# EasyEDA Pro project exp7lb.eprj

# Schematic Schematic1
Board Name: Board1; Create Date: 2025-12-22; Page Name: P1; Project Name: exp7lb; Schematic Name: Schematic1; Update Date: 2025-12-23; Company: 嘉立创EDA; Page Size: A4; Version: V1.0
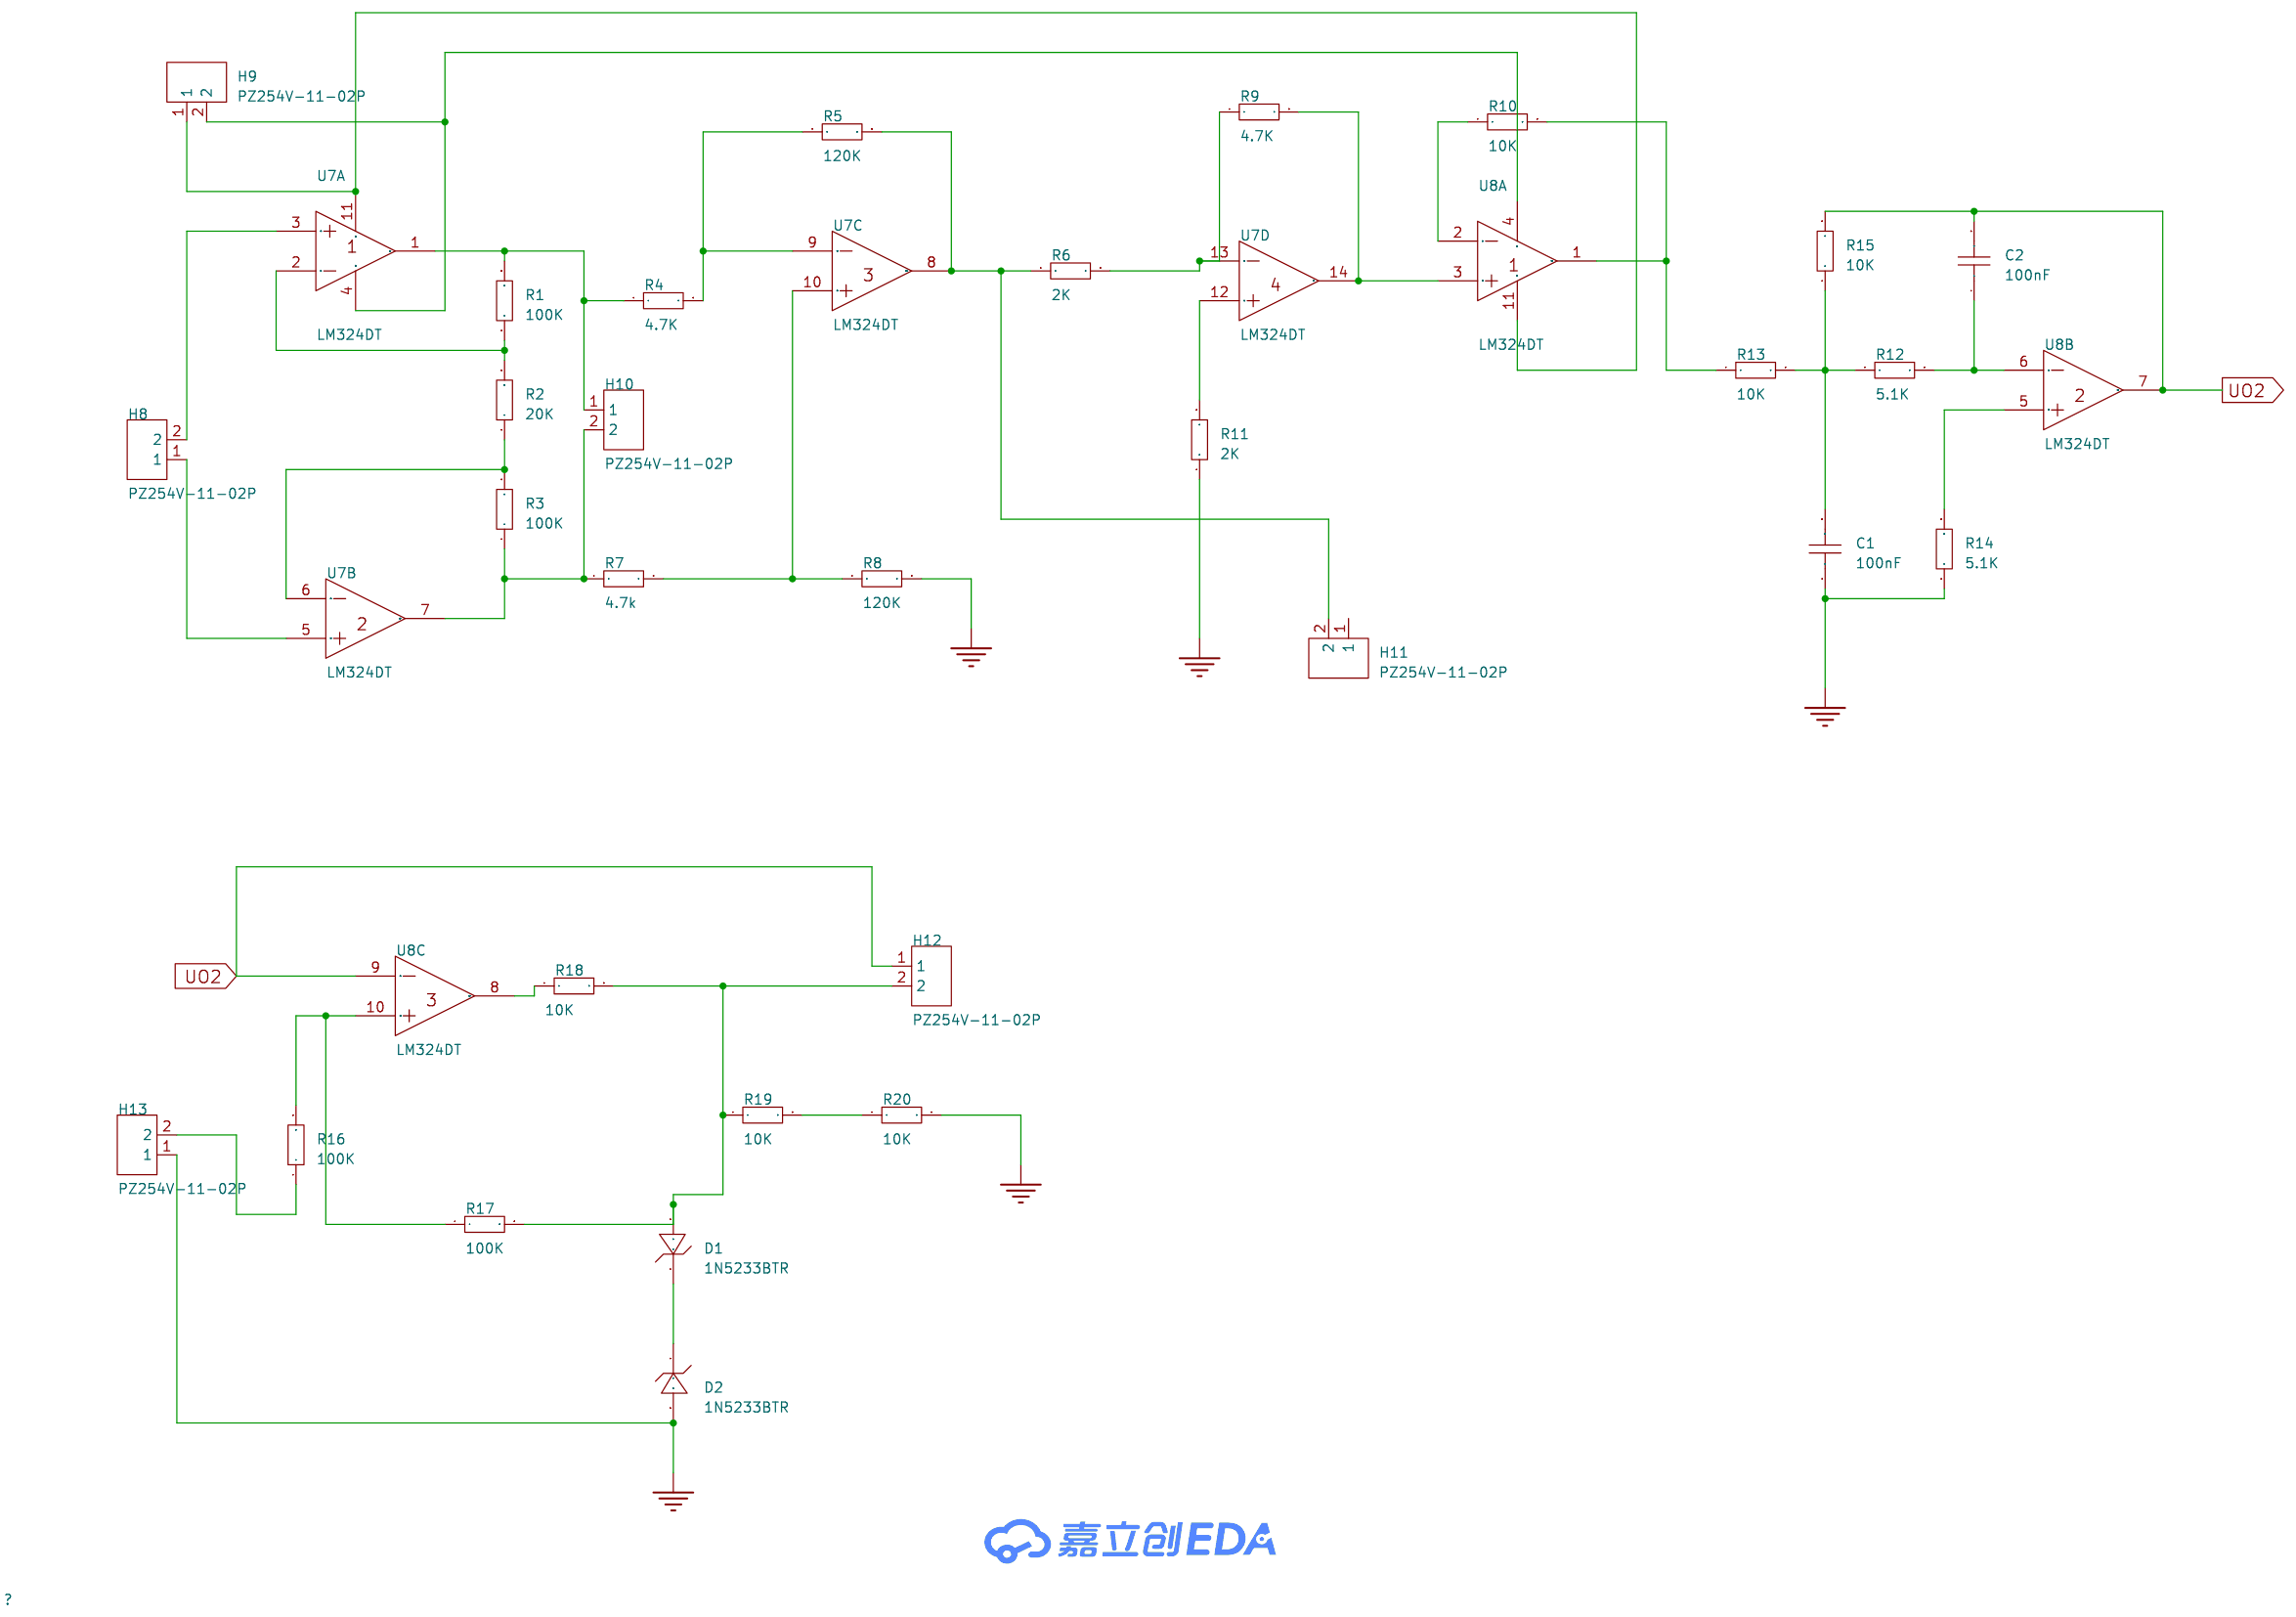
[diagram p0: schematic sheet]

## Parts
C1  100nF  [C0603]
C2  100nF  [C0603]
D1  1N5233BTR  [DO-35_BD2.0-L4.2-P8.20-D0.5-RD]
D2  1N5233BTR  [DO-35_BD2.0-L4.2-P8.20-D0.5-RD]
H8  PZ254V-11-02P  [HDR-TH_2P-P2.54-V-M]
H9  PZ254V-11-02P  [HDR-TH_2P-P2.54-V-M]
H10  PZ254V-11-02P  [HDR-TH_2P-P2.54-V-M]
H11  PZ254V-11-02P  [HDR-TH_2P-P2.54-V-M]
H12  PZ254V-11-02P  [HDR-TH_2P-P2.54-V-M]
H13  PZ254V-11-02P  [HDR-TH_2P-P2.54-V-M]
R1  100K  [R0603]
R2  20K  [R0603]
R3  100K  [R0603]
R4  4.7K  [R0603]
R5  120K  [R0603]
R6  2K  [R0603]
R7  4.7k  [R0603]
R8  120K  [R0603]
R9  4.7K  [R0603]
R10  10K  [R0603]
R11  2K  [R0603]
R12  5.1K  [R0603]
R13  10K  [R0603]
R14  5.1K  [R0603]
R15  10K  [R0603]
R16  100K  [R0603]
R17  100K  [R0603]
R18  10K  [R0603]
R19  10K  [R0603]
R20  10K  [R0603]
U7  LM324DT  [SOIC-14_L8.7-W3.9-P1.27-LS6.0-BL]  (sections 1,2,3,4)
U8  LM324DT  [SOIC-14_L8.7-W3.9-P1.27-LS6.0-BL]  (sections 1,2,3)

## Library data of the parts
C1 C2 = CAP_0603: Supplier Footprint: 0603
D1 D2 = 1N5233BTR: LCSC Part Name: 独立式 耐压:6V 电流:5uA; Supplier Part: C258176; Manufacturer: onsemi(安森美); Supplier Footprint: DO-35; JLCPCB Part Class: 扩展库; Datasheet: https://item.szlcsc.com/datasheet/1N5233BTR/251202.html; Supplier: LCSC; Diode Configuration: 独立式; Zener Voltage(Nom): 6V; Reverse Leakage Current (Ir): 5uA; Zener Voltage(Range): 5.7V~6.3V; Pd - Power Dissipation: 500mW; Impedance(Zzt): 7Ω; Impedance(Zzk): 1.6kΩ; Operating Junction Temperature Range: -65℃~+200℃
H8-H13 = PZ254V-11-02P: LCSC Part Name: 1x2P 间距:2.54mm 方针 直插; Supplier Part: C492401; Manufacturer: XFCN(兴飞); Supplier Footprint: 插件,P=2.54mm; JLCPCB Part Class: 扩展库; Datasheet: https://item.szlcsc.com/datasheet/PZ254V-11-02P/502957.html; Supplier: LCSC; Pin Structure: 1x2P; Pitch: 2.54mm; Circluar Pins/Square Pins: 方针; Mounting Type: 直插; Number of Rows: 单排; Number of Pins: 2P; Length of Mating Pin: 6mm; Insulation Height: 2.5mm; Length of End Connection Pin: 3mm; Contact Material: 黄铜; Operating Temperature: -40℃~+105℃; Color: 黑色
R1-R20 = Res_0603: Supplier Footprint: 0603
U7 U8 = LM324DT: LCSC Part Name: 低功耗四路运算放大器; Supplier Part: C71035; Manufacturer: ST(意法半导体); Supplier Footprint: SOIC-14; JLCPCB Part Class: 基础库; Datasheet: https://item.szlcsc.com/datasheet/LM324DT/72134.html; Supplier: LCSC; Number of Channels: 四路; Maximum Power Supply Range (Vdd-Vss): 30V; Gain Bandwidth Product: 1.3MHz; Vos - Input Offset Voltage: 5mV; Input Offset Voltage Drift(Vos TC): 30uV/℃; Slew Rate: 20V/us; Ib - Input Bias Current: 300nA; Input Offset Current(Ios): 20nA; Noise density(eN): 40nV/√Hz@1kHz; Common Mode Rejection Ratio(CMRR): 80dB; Input offset current drift(Ios TC): 200pA/℃; Quiescent Current: 1.2mA; Output Current: 70mA; Operating Temperature: 0℃~+70℃; Single supply: 3V~30V; Dual Supply: -15V~-1.5V；1.5V~15V

## Nets
GND: C1.1 D2.2 H13.1 R8.2 R11.1 R14.1 R20.2
UO2: C2.2 H12.1 R15.2 U8.7(OUT2) U8.9(IN3-)
$1N1789: H8.1 U7.5(IN2+)
$1N1795: R2.1 R3.2 U7.6(IN2-)
$1N1810: H10.2 R3.1 R7.1 U7.7(OUT2)
$1N1825: R7.2 R8.1 U7.10(IN3+)
$1N1857: H10.1 R1.2 R4.1 U7.1(OUT1)
$1N1892: R4.2 R5.1 U7.9(IN3-)
$1N1908: H11.2 R5.2 R6.1 U7.8(OUT3)
$1N1971: R6.2 R9.1 U7.13(IN4-)
$1N1988: R9.2 U7.14(OUT4) U8.3(IN1+)
$1N2003: R11.2 U7.12(IN4+)
$1N2040: R10.1 U8.2(IN1-)
$1N2046: R10.2 R13.1 U8.1(OUT1)
$1N2061: C1.2 R12.1 R13.2 R15.1
$1N2102: R14.2 U8.5(IN2+)
$1N2108: C2.1 R12.2 U8.6(IN2-)
$1N2191: R18.1 U8.8(OUT3)
$1N2196: R16.2 R17.1 U8.10(IN3+)
$1N2210: H13.2 R16.1
$1N2232: D1.1 D2.1
$1N2248: D1.2 H12.2 R17.2 R18.2 R19.1
$1N2279: R19.2 R20.1
$1N2425: H9.1 U7.11(VCC-) U8.11(VCC-)
$1N2444: H9.2 U7.4(VCC+) U8.4(VCC+)
$1N2454: R1.1 R2.2 U7.2(IN1-)
$1N2488: H8.2 U7.3(IN1+)

Not connected (* = marked no-connect by the designer): H11 1

# Board PCB2
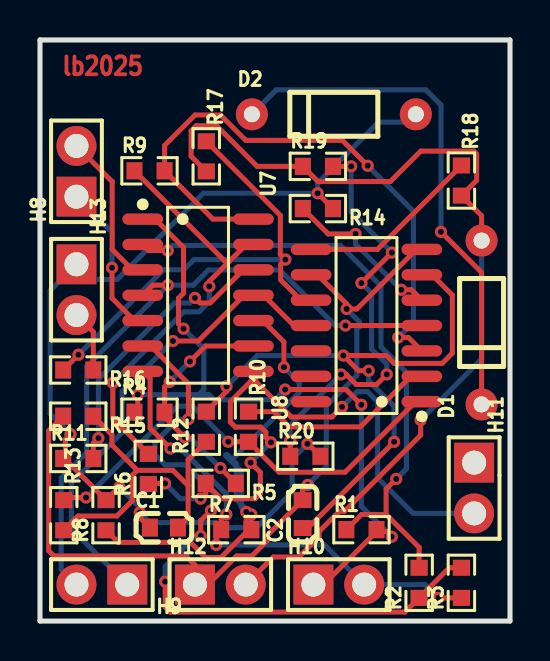
[diagram p1: board, top side]
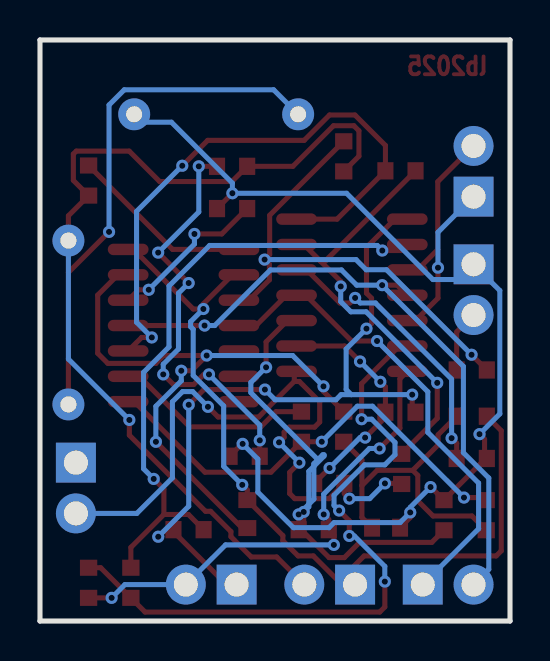
[diagram p2: board, bottom side, seen from below]

Outline 23.51 x 29.08 mm; copper layers: Top Layer, Bottom Layer. Coordinates in mm from the lower left corner of the outline.
Outline path: 0,29.08 23.51,29.08 23.51,0 0,0 0,29.08
Stack: Top Layer 0.035mm / Dielectric1 1.51mm FR4 er 4.5 / Bottom Layer 0.035mm

## Design rules (mm)
template: JLCPCB Capability(Two Layers Board)
spacing copperThickness1oz (default): track to track 0.102, other pairs 0.152 to 0.3
spacing copperThickness2oz: track to track 0.203, other pairs 0.152 to 0.3
track width copperThickness1oz (default): min 0.127, default 0.254, max 2.54
track width copperThickness2oz: min 0.203, default 0.254, max 2.54
differential pair differentialPair (default): width min 0.127, default 0.254, max 2.54; gap min 0.152, default 0.152
via viaSize (default): diameter min 0.5, default 0.61, max 10; hole min 0.3, default 0.305, max 6.3

## Placement (name value [footprint] x y rotation side)
C1  100nF  [C0603]  6.2 4.67 0 top
C2  100nF  [C0603]  13.14 5.35 90 top
D1  1N5233BTR  [DO-35_BD2.0-L4.2-P8.20-D0.5-RD]  22.08 14.94 90 top
D2  1N5233BTR  [DO-35_BD2.0-L4.2-P8.20-D0.5-RD]  14.7 25.36 0 top
H8  PZ254V-11-02P  [HDR-TH_2P-P2.54-V-M]  1.82 22.51 90 top
H9  PZ254V-11-02P  [HDR-TH_2P-P2.54-V-M]  3.09 1.82 180 top
H10  PZ254V-11-02P  [HDR-TH_2P-P2.54-V-M]  14.94 1.82 0 top
H11  PZ254V-11-02P  [HDR-TH_2P-P2.54-V-M]  21.71 6.66 270 top
H12  PZ254V-11-02P  [HDR-TH_2P-P2.54-V-M]  9.02 1.82 0 top
H13  PZ254V-11-02P  [HDR-TH_2P-P2.54-V-M]  1.82 16.58 270 top
R1  100K  [R0603]  16.08 4.57 0 top
R2  20K  [R0603]  18.96 1.91 90 top
R3  100K  [R0603]  21.07 1.91 90 top
R4  4.7K  [R0603]  5.48 10.45 0 top
R5  120K  [R0603]  9.04 6.89 180 top
R6  2K  [R0603]  5.42 7.61 90 top
R7  4.7k  [R0603]  9.82 4.57 0 top
R8  120K  [R0603]  3.3 5.3 90 top
R9  4.7K  [R0603]  5.48 22.53 0 top
R10  10K  [R0603]  10.43 9.73 270 top
R11  2K  [R0603]  1.91 8.14 0 top
R12  5.1K  [R0603]  8.32 9.73 90 top
R13  10K  [R0603]  1.19 5.3 270 top
R14  5.1K  [R0603]  13.9 20.64 180 top
R15  10K  [R0603]  1.91 10.25 180 top
R16  100K  [R0603]  1.91 12.57 180 top
R17  100K  [R0603]  8.32 23.26 270 top
R18  10K  [R0603]  21.07 22.05 270 top
R19  10K  [R0603]  13.9 22.76 0 top
R20  10K  [R0603]  13.27 8.25 0 top
U7  LM324DT  [SOIC-14_L8.7-W3.9-P1.27-LS6.0-BL]  7.91 16.31 270 top
U8  LM324DT  [SOIC-14_L8.7-W3.9-P1.27-LS6.0-BL]  16.33 14.79 90 top

## Footprints (pads in the part's own frame, mm; a bottom-side part is the same pattern mirrored in y, then rotated)
C0603
  rect 0.8x0.9 smd: 1(-0.7,0) 2(0.7,0)
DO-35_BD2.0-L4.2-P8.20-D0.5-RD
  round 1.6 hole 0.8: 1(-4.1,0) 2(4.1,0)
HDR-TH_2P-P2.54-V-M
  rect 2x2 hole 1.2: 1(-1.27,0)
  round 2 hole 1.2: 2(1.27,0)
R0603
  rect 0.806x0.864 smd: 1(-0.753,0) 2(0.753,0)
SOIC-14_L8.7-W3.9-P1.27-LS6.0-BL
  oval 0.574x2.038 smd: 1(-3.81,-2.769) 2(-2.54,-2.769) 3(-1.27,-2.769) 4(0,-2.769) 5(1.27,-2.769) 6(2.54,-2.769) 7(3.81,-2.769) 8(3.81,2.769) 9(2.54,2.769) 10(1.27,2.769) 11(0,2.769) 12(-1.27,2.769) 13(-2.54,2.769) 14(-3.81,2.769)

## Nets
As in the schematic.

Pads without a net: H11 1; U8 12 13 14

## Via types
v1: diameter 0.61, hole 0.305, Top Layer to Bottom Layer, 62 vias

## Routing (per net, layer and track width the routed paths; a pad name or vN(x,y) marks a point on that pad's centre or on a via; arc(x,y) is an arc through that point)
GND: length 51.9
  Top Layer w0.254: 1.27,8.08 1.27,9.1 v1(1.53,9.35) ; 1.27,8.08 1.21,8.08 R11.1 ; 1.27,8.08 R8.2 3.96,6.7 v1(3.97,6.7) ; v1(4.99,5.44) 4.99,5.18 5.5,4.67 ; 14.02,8.25 13.4,8.87 v1(13.37,8.87) ; v1(13.88,21.41) R14.1
  Bottom Layer w0.254: v1(13.37,8.87) 12.61,8.11 12.61,6.45 10.83,4.67 9.05,4.67 8.8,4.93 5.5,4.93 v1(4.99,5.44) 4.99,5.69 v1(3.97,6.7) ; v1(1.53,9.35) 0.51,10.37 0.51,16.54 H13.1 2.59,17.09 3.86,17.09 8.17,21.41 v1(13.88,21.41) 13.88,21.92 16.93,24.97 18.4,24.97 D2.2
UO2: length 41.7
  Top Layer w0.254: 8.57,1.99 7.3,3.26 0.69,3.26 0.44,3.51 0.44,9.53 R15.2 ; 8.57,1.99 9.84,3.26 10.6,3.26 11.36,4.02 11.36,4.28 C2.2 13.14,6.56 v1(13.39,6.81) ; 8.57,1.99 8.4,1.82 H12.1 ; U8.9 13.88,17.33 15.34,15.87 v1(15.34,15.62) 15.84,15.62 18.82,18.6 19.1,18.6
  Bottom Layer w0.254: v1(13.39,6.81) 14.32,7.74 14.32,10.77 15.84,12.29 15.84,14.6 15.97,14.73 15.97,14.98 v1(15.34,15.62)
$1N1789: length 7.8
  Top Layer w0.254: v1(3.6,17.68) 3.6,16.16 4.62,15.14 5.03,15.14 U7.5
  Bottom Layer w0.254: H8.1 3.6,19.46 v1(3.6,17.68)
$1N1795: length 34.1
  Top Layer w0.254: 5.14,13.77 5.25,13.66 5.64,13.66 7.42,11.88 v1(7.42,10.1) ; R3.2 20.47,2.67 R2.1 18.25,0.45 6.52,0.45 6.26,0.7 v1(6.26,1.97) ; v1(8.04,4.26) 8.04,5.02 v1(8.55,5.53)
  Bottom Layer w0.254: v1(8.55,5.53) 8.8,5.78 8.8,6.29 7.28,7.82 6.26,7.82 5.75,8.32 5.75,8.94 6.91,10.1 v1(7.42,10.1) ; v1(6.26,1.97) 6.26,2.74 7.78,4.26 v1(8.04,4.26)
$1N1810: length 24.3
  Top Layer w0.254: v1(19.92,1.16) R3.1 ; v1(8.81,3.81) 8.81,4.32 R7.1 9.06,5.08 v1(9.32,5.33) ; v1(6.52,8.64) 5.51,9.65 5.51,12.12 U7.7
  Bottom Layer w0.254: v1(6.52,8.64) 7.03,8.64 9.32,6.35 v1(9.32,5.33) ; v1(19.92,1.16) 19.26,1.82 H10.2 14.22,3.81 v1(8.81,3.81)
$1N1825: length 26.3
  Top Layer w0.254: R8.1 3.91,3.94 7.52,3.94 8.28,3.17 9.05,3.17 10.32,4.44 v1(10.32,5.46) ; R7.2 v1(10.57,5.33) ; U7.10 10.72,14.99 11.18,14.99 12.2,13.97 v1(12.2,12.7)
  Bottom Layer w0.254: 9.81,7.75 10.06,7.49 10.06,5.84 ; 9.81,7.75 9.81,7.88 9.55,8.13 ; 9.81,7.75 9.81,6.1 10.06,5.84 ; 9.81,7.75 9.3,8.25 9.3,8.32 9.36,8.32 9.55,8.13 ; 10.06,5.84 10.06,5.72 v1(10.32,5.46) ; 10.06,5.84 v1(10.57,5.33) ; 9.55,8.13 9.66,8.13 12.96,11.43 12.96,11.94 v1(12.2,12.7)
$1N1857: length 35.9
  Top Layer w0.254: v1(4.89,11.33) 4.89,10.62 R4.1 ; 16.83,4.47 14.18,1.82 H10.1 ; 16.83,4.47 R1.2 ; 16.83,4.47 17.34,4.47 v1(17.59,4.22) ; v1(16.07,10.82) 15.31,11.59 v1(12.26,11.59) ; U7.1 5.76,20.12 7.18,18.7 7.18,16.41 6.92,16.16 6.92,14.89 v1(7.18,14.63)
  Bottom Layer w0.254: v1(17.59,4.22) 16.07,5.74 v1(16.07,10.82) ; v1(7.18,14.63) 8.19,13.62 8.19,11.59 7.94,11.33 ; 7.94,11.33 8.45,11.33 8.7,11.08 11.75,11.08 v1(12.26,11.59) ; 7.94,11.33 v1(4.89,11.33)
$1N1892: length 11.7
  Top Layer w0.254: v1(7.25,9.18) 6.23,10.2 R4.2 6.23,11.72 v1(6.48,11.97) ; v1(9.02,7.66) R5.1 ; 10.68,13.77 8.28,13.77 v1(7.5,12.99)
  Bottom Layer w0.254: v1(6.48,11.97) v1(7.5,12.99) ; v1(7.25,9.18) 7.5,9.18 v1(9.02,7.66)
$1N1908: length 32.9
  Top Layer w0.254: R6.1 5.45,6.89 v1(6.25,6.89) ; v1(11.55,8.94) 11.3,9.2 11.3,9.45 11.04,9.7 9.77,9.7 9.52,9.96 9.52,10.97 10.53,11.99 10.79,11.99 ; 10.79,11.99 10.79,12.38 U7.8 ; 10.79,11.99 12.57,10.21 14.6,10.21 v1(15.11,10.72) ; v1(10.53,7.93) 11.02,7.44 11.02,6.38 10.77,6.13 9.05,6.13 R5.2 8.29,6.38 v1(8.03,6.13)
  Bottom Layer w0.254: v1(6.25,6.89) 7.02,6.13 v1(8.03,6.13) ; v1(15.11,10.72) 15.87,11.48 16.38,11.48 16.88,10.97 16.88,7.16 18.66,5.39 H11.2 ; v1(11.55,8.94) v1(10.53,7.93)
$1N1971: length 21.4
  Top Layer w0.254: v1(3.64,11.92) 3.64,10.14 5.42,8.37 ; 9.48,18.02 10.31,18.85 U7.13 ; 9.48,18.02 8.47,17 v1(8.47,16.75) ; 9.48,18.02 9.24,18.02 R9.1
  Bottom Layer w0.254: v1(8.47,16.75) 8.47,15.99 7.96,15.48 7.2,15.48 v1(3.64,11.92)
$1N1988: length 29.9
  Top Layer w0.254: v1(17.91,14.19) 18.42,14.19 19.1,13.52 ; U7.14 8.65,20.12 R9.2 6.23,23.8 7.75,25.33 9.02,25.33 10.29,24.06 15.12,24.06 v1(16.39,22.79)
  Bottom Layer w0.254: v1(16.39,22.79) 18.68,20.5 18.68,14.95 v1(17.91,14.19)
$1N2003: length 14.3
  Top Layer w0.254: R11.2 2.67,8.9 v1(2.92,9.15) ; U7.12 10.17,17.58 8.51,15.92 8,15.92 v1(7.75,16.17)
  Bottom Layer w0.254: v1(2.92,9.15) 2.92,12.11 6.73,15.92 7.49,15.92 v1(7.75,16.17)
$1N2040: length 10
  Top Layer w0.254: R10.1 11.7,10.48 12.46,9.72 16.02,9.72 18.56,12.26 19.09,12.26 19.1,12.25
$1N2046: length 22.7
  Top Layer w0.254: v1(9.41,8.97) R10.2 11.95,7.45 15.26,7.45 18.79,10.98 19.1,10.98 ; v1(2.3,6.18) 1.32,6.18 R13.1
  Bottom Layer w0.254: v1(2.3,6.18) 6.87,10.75 7.64,10.75 v1(9.41,8.97)
$1N2061: length 17
  Top Layer w0.254: C1.2 7.41,5.18 7.41,6.78 ; R13.2 1.9,5.26 3.85,5.26 4.61,6.02 4.61,7.29 4.87,7.54 ; 7.41,6.78 6.64,7.54 4.87,7.54 ; 7.41,6.78 7.41,8.06 R12.1 ; 4.87,7.54 3.6,8.81 3.6,9.32 R15.1
$1N2102: length 8.1
  Top Layer w0.254: R14.2 14.41,19.37 v1(15.78,19.37) ; v1(18.07,16.58) 18.57,16.58 19.1,16.06
  Bottom Layer w0.254: v1(15.78,19.37) 15.78,18.87 v1(18.07,16.58)
$1N2108: length 30.9
  Top Layer w0.254: v1(17.71,8.97) 13.39,4.65 C2.1 ; R12.2 9.33,11.49 v1(9.33,11.75) ; 19.1,17.33 19.6,17.33 20.62,16.31 20.62,13.4 20.11,12.89 17.71,12.89 17.31,13.29 v1(15.17,13.29) 15.93,12.53 v1(16.44,12.53)
  Bottom Layer w0.254: v1(17.71,8.97) 17.71,10.75 16.44,12.02 v1(16.44,12.53) ; v1(9.33,11.75) 10.87,13.29 v1(15.17,13.29)
$1N2191: length 9.3
  Top Layer w0.254: R18.1 16.88,18.6 U8.8
$1N2196: length 24
  Top Layer w0.254: U8.10 13.05,16.06 12.03,17.08 12.03,17.85 v1(12.27,18.09) 12.02,18.34 12.02,20.31 R17.1 ; R16.2 v1(1.92,13.33)
  Bottom Layer w0.254: v1(12.27,18.09) 7.7,18.09 7.19,17.58 6.18,17.58 v1(1.92,13.33)
$1N2210: length 3.1
  Top Layer w0.254: R16.1 2.67,14.47 H13.2
$1N2232: length 26.1
  Top Layer w0.254: v1(20.05,19.48) 22.08,17.45 D1.1
  Bottom Layer w0.254: v1(20.05,19.48) 20.05,25.83 19.29,26.59 11.82,26.59 D2.1
$1N2248: length 46.6
  Top Layer w0.254: D1.2 22.08,20.28 R18.2 21.84,22.05 21.84,23.37 21.69,23.52 19.04,23.52 17.52,22 13.91,22 R19.1 10.86,22.76 8.83,24.79 7.81,24.79 7.56,24.54 7.56,23.26 8.32,22.5 ; v1(19.04,10.06) 19.04,9.3 15.23,5.49 14.97,5.49 13.96,4.48 13.96,4.22 12.94,3.21 11.67,3.21 H12.2
  Bottom Layer w0.254: D1.2 22.08,13.11 v1(19.04,10.06)
$1N2279: length 21.2
  Top Layer w0.254: v1(17.34,12.34) 16.83,11.84 15.82,11.84 15.31,12.34 v1(15.06,12.34) ; v1(12.52,9.04) R20.1 ; R19.2 v1(15.56,22.76) ; v1(17.6,18.44) v1(16.07,16.92)
  Bottom Layer w0.254: v1(15.56,22.76) 15.56,20.47 v1(17.6,18.44) ; v1(16.07,16.92) 16.58,16.41 16.58,13.61 17.34,12.85 v1(17.34,12.34) ; v1(15.06,12.34) 12.52,9.8 v1(12.52,9.04)
$1N2425: length 23.9
  Top Layer w0.254: v1(6.65,14.02) 7.92,14.02 10.21,16.3 10.67,16.3 ; U7.11 11.18,16.31 12.7,14.79 U8.11
  Bottom Layer w0.254: H9.1 1.57,4.62 1.57,6.9 4.11,9.44 4.11,11.48 v1(6.65,14.02)
$1N2444: length 33.1
  Top Layer w0.254: v1(15.28,14.79) 19.1,14.79 ; U7.4 5.64,16.81 v1(6.4,16.81)
  Bottom Layer w0.254: v1(15.28,14.79) 14.77,14.79 11.98,17.57 8.43,17.57 7.67,16.81 v1(6.4,16.81) 2.33,12.75 2.33,8.43 1.06,7.16 1.06,2.59 1.82,1.82
$1N2454: length 31
  Top Layer w0.254: v1(17.82,7.11) 17.31,6.61 17.31,5.33 ; R1.1 16.09,5.33 17.31,5.33 ; 17.31,5.33 18.96,3.68 R2.2 ; U7.2 5.44,18.54 v1(6.39,18.54)
  Bottom Layer w0.254: v1(17.82,7.11) 18.32,7.62 18.32,12.45 17.06,13.72 17.06,16.77 15.02,18.8 6.64,18.8 v1(6.39,18.54)
$1N2488: length 7.9
  Top Layer w0.254: U7.3 4.63,17.58 3.61,18.59 3.61,21.99 H8.2

## Text on the board
Top Layer: lb2025
